# Altium project OPAL 6KVA - Half Bridge Eval.PrjPcb
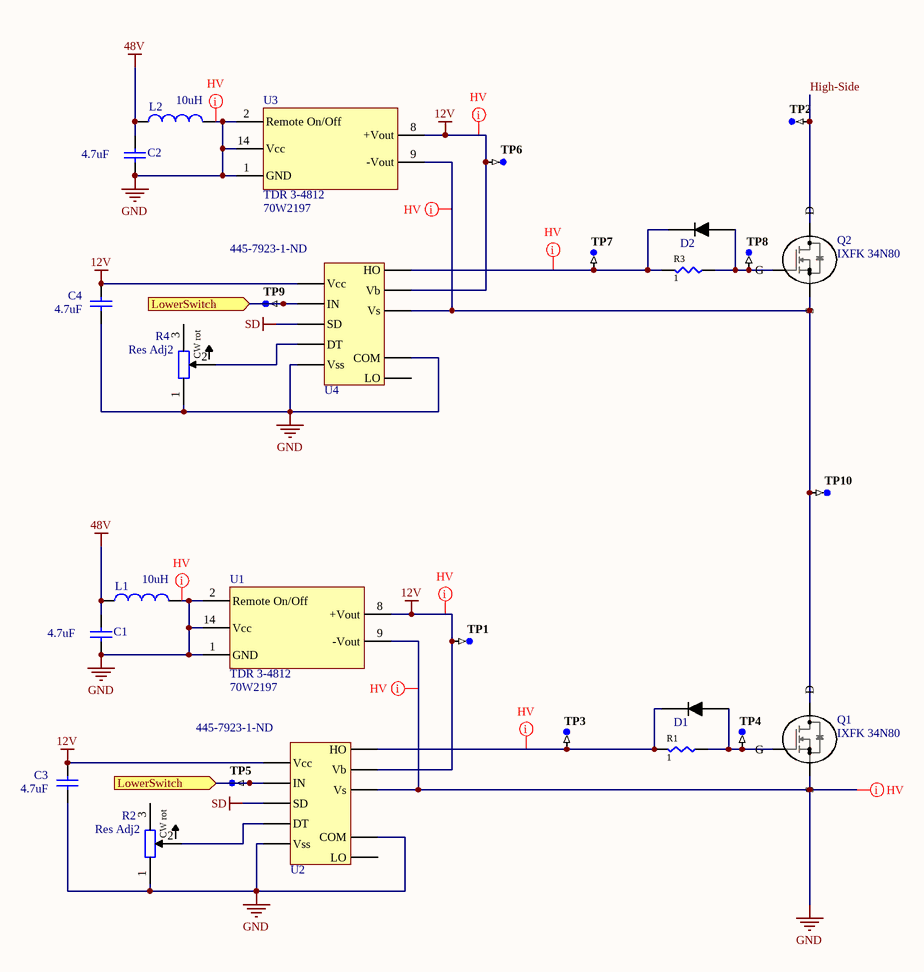
[diagram p0: Gate-drive.SchDoc]
1 sheet, 28 parts. Net scope: flat (ports and power ports of the same name join across sheets).
Board file: Half-bridge_eval.PcbDoc

## Sheet Gate-drive.SchDoc
size A4

### Parts
C1  value 4.7uF  [C4532]  (hidden comment: Cap)
C2  value 4.7uF  [C4532]  (hidden comment: Cap)
C3  value 4.7uF  Supplier Part Number 1: 445-7923-1-ND  [C4532]  (hidden comment: Cap)
C4  value 4.7uF  Supplier Part Number 1: 445-7923-1-ND  [C4532]  (hidden comment: Cap)
D1  1N4148  [DO-35_02]  (value not drawn)
D2  1N4148  [DO-35_02]  (value not drawn)
L1  value 10uH  [TCK-047]  (hidden comment: Inductor)
L2  value 10uH  [TCK-047]  (hidden comment: Inductor)
Q1  IXFK 34N80  [TO-264 AA]
Q2  IXFK 34N80  [TO-264 AA]
R1  1  [R_1206]
R2  Res Adj2  [CT-6EP]
R3  1  [R_1206]
R4  Res Adj2  [CT-6EP]
TP1  TP-SM-C-100  [TP-SM-C-100]  (value not drawn)  (no BOM)
TP2  TP-SM-C-100  [TP-SM-C-100]  (value not drawn)  (no BOM)
TP3  TP-SM-C-100  [TP-SM-C-100]  (value not drawn)  (no BOM)
TP4  TP-SM-C-100  [TP-SM-C-100]  (value not drawn)  (no BOM)
TP5  TP-SM-C-100  [TP-SM-C-100]  (value not drawn)  (no BOM)
TP6  TP-SM-C-100  [TP-SM-C-100]  (value not drawn)  (no BOM)
TP7  TP-SM-C-100  [TP-SM-C-100]  (value not drawn)  (no BOM)
TP8  TP-SM-C-100  [TP-SM-C-100]  (value not drawn)  (no BOM)
TP9  TP-SM-C-100  [TP-SM-C-100]  (value not drawn)  (no BOM)
TP10  TP-SM-C-100  [TP-SM-C-100]  (value not drawn)  (no BOM)
U1  TDR 3-4812  Supplier Part Number 1: 70W2197  [PID DC-DC Converter - duplicate]
U2  IR21094  [DIP14]  (value not drawn)
U3  TDR 3-4812  Supplier Part Number 1: 70W2197  [PID DC-DC Converter - duplicate]
U4  IR21094  [DIP14]  (value not drawn)

### Ports
LowerSwitch (in)

### Nets
12V: C3.2 C4.2 TP1.1 TP6.1 U1.8(+Vout) U2.1(Vcc) U2.13(Vb) U3.8(+Vout) U4.1(Vcc) U4.13(Vb)
48V: C1.2 C2.2 L1.1 L2.1
GND: C1.1 C2.1 C3.1 C4.1 L1.2 L2.2 Q1.3(S) R2.1 R4.1 U1.1(GND) U1.2(Remote_On/Off) U1.9(-Vout) U1.14(Vcc) U2.5(Vss) U2.6(COM) U2.11(Vs) U3.1(GND) U3.2(Remote_On/Off) U3.14(Vcc) U4.5(Vss) U4.6(COM)
SD: U2.3(SD) U4.3(SD)
High-Side: Q2.2(D) TP2.1
NetD1_1: D1.1(Cathode) R1.1 TP3.1 U2.12(HO)
NetD1_2: D1.2(Anode) Q1.1(G) R1.2 TP4.1
NetD2_1: D2.1(Cathode) R3.1 TP7.1 U4.12(HO)
NetD2_2: D2.2(Anode) Q2.1(G) R3.2 TP8.1
NetQ1_2: Q1.2(D) Q2.3(S) TP10.1 U3.9(-Vout) U4.11(Vs)
NetR2_2: R2.2 U2.4(DT)
NetR4_2: R4.2 U4.4(DT)
NetTP5_1: TP5.1 TP9.1 U2.2(IN) U4.2(IN) ; port LowerSwitch

Not connected (* = marked no-connect by the designer): R2 3; R4 3; U2 7(LO); U4 7(LO)

### Layout directives
net class HV: 12V, GND, NetD1_1, NetD2_1, NetQ1_2

### Notes on the sheet
- (in symbol Res Adj2) CW rot

### Library data of the parts
C1-C4 = Cap: Capacitor; Manufacturer: TDK; Manufacturer Part Number: CGA8N3X7S2A475K230KB; Tolerance: 10%; Voltage Rating: 100V; Dielectric: X7S; Published: 8-Jun-2000; LatestRevisionDate: 17-Jul-2002; LatestRevisionNote: Re-released for DXP Platform.; PackageReference: RAD-0.3; Publisher: Altium Limited; PackageDescription: Radial Cap, Thru-Hole; 2 Leads; 0.3 in Pin Spacing; Supplier 1: Digi-Key; Pricing 1: 1=1.92, 10=1.518, 100=1.1385 (USD); Case/Package: 1812; Weight: 0.000952oz; Case Code (Metric): 4532; Case Code (Imperial): 1812; Min Operating Temperature: -55°C; Max Operating Temperature: 125°C; Packaging: Tape and Reel; Capacitance: 4.7uF; Termination: SMD/SMT; Package Quantity: 1; Voltage Rating (DC): 100V; Composition: Ceramic; Length: 4.5mm; Height: 1.6mm; Width: 0.126inch; Thickness: 0.091inch; Depth: 3.2mm; REACH SVHC: No SVHC; ComponentLink1URL: https://datasheet.ciiva.com/24217/cga8n3x7s2a475k230kb-266118-24217101.pdf; ComponentLink1Description: https://datasheet.ciiva.com/24217/cga8n3x7s2a475k230kb-266118-24217101.pdf
  C1 C2: Supplier Part Number 1: 445-7923-1-ND; Stock 1: 236
  C3 C4: Stock 1: 0
D1 D2 = 1N4148: Diode; Manufacturer: Fairchild Semiconductor; Forward Voltage: 1V; Reverse Recovery Time: 4ns; Element Configuration: Single; Polarity: Standard; Current Rating: 200mA; Capacitance: 4pF; Voltage Rating (DC): 100V; Peak Non-Repetitive Surge Current: 4A; Max Forward Surge Current (Ifsm): 1A; Max Power Dissipation: 500mW; Peak Reverse Current: 5uA; Outside Diameter: 1.85mm; Supplier 1: Digi-Key; Manufacturer Part Number: 1N4148; Stock 1: 0; Pricing 1: 25=4 (USD); Mount: Through Hole; Number of Pins: 2; Weight: 0.01lb; Contact Plating: Tin; Min Operating Temperature: -65°C; Max Operating Temperature: 175°C; Packaging: Bulk; Output Current: 200mA; Forward Current: 200mA; Max Repetitive Reverse Voltage (Vrrm): 100V; Package Quantity: 2000; Recovery Time: 4ns; Max Surge Current: 4A; Reverse Voltage (DC): 100V; Average Rectified Current: 200mA; Power Dissipation: 500mW; Diameter: 1.91mm; Length: 4.56mm; Height: 4.56mm; Width: 1.91mm; Radiation Hardening: No; Lead Free: Lead Free; REACH SVHC: No SVHC; ComponentLink1URL: https://datasheet.ciiva.com/910/1n914-910546.pdf; ComponentLink1Description: https://datasheet.ciiva.com/910/1n914-910546.pdf; ComponentLink2URL: https://datasheet.ciiva.com/1242/1716967-1242233.pdf; ComponentLink2Description: https://datasheet.ciiva.com/1242/1716967-1242233.pdf; ComponentLink3URL: https://datasheet.ciiva.com/3304/fdll914b-3304217.pdf; ComponentLink3Description: https://datasheet.ciiva.com/3304/fdll914b-3304217.pdf; ComponentLink4URL: https://datasheet.ciiva.com/25951/fdll914b-25951516.pdf; ComponentLink4Description: https://datasheet.ciiva.com/25951/fdll914b-25951516.pdf; ComponentLink5URL: https://datasheet.ciiva.com/27049/743285-27049708.pdf; ComponentLink5Description: https://datasheet.ciiva.com/27049/743285-27049708.pdf; ComponentLink6URL: https://datasheet.ciiva.com/16740/1n4148-16740829.pdf; ComponentLink6Description: https://datasheet.ciiva.com/16740/1n4148-16740829.pdf; Supplier Part Number 1: 1N4148-DIE-ND
L1 L2 = Inductor: Code_IEC: 1005; Published: 8-Jun-2000; LatestRevisionDate: 29-May-2009; LatestRevisionNote: IPC-7351 Footprint Added.; PackageReference: 0402-A; Publisher: Altium Limited; PackageDescription: Chip Inductor; Code_JEITA: 0402
Q1 Q2 = IXFK 34N80: MOSFET 34A; Manufacturer: IXYS; Rise Time: 45ns; Rds On Max: 240mR; Input Capacitance: 7.5nF; Recovery Time: 250ns; Drain to Source Breakdown Voltage: 800V; Fall Time: 40ns; Power Dissipation: 560W; Turn-Off Delay Time: 100ns; Element Configuration: Single; Gate to Source Voltage (Vgs): 20V; Supplier 1: Digikey; Manufacturer Part Number: IXFK34N80; Stock 1: 25; Pricing 1: 1=22.64, 10=20.94, 25=19.2424, 100=17.884, 250=16.4126 (USD); Case/Package: TO-264-3; Min Operating Temperature: -55°C; Max Operating Temperature: 150°C; Package Quantity: 25; Packaging: Rail/Tube; Continuous Drain Current (ID): 34A; Drain to Source Resistance: 240mR; Drain to Source Voltage (Vdss): 800V; Max Power Dissipation: 560W; Current Rating: 34A; Voltage Rating (DC): 800V; Lead Free: Lead Free; ComponentLink1URL: https://datasheet.ciiva.com/4446/98560-63299-4446514.pdf; ComponentLink1Description: https://datasheet.ciiva.com/4446/98560-63299-4446514.pdf; ComponentLink2URL: https://datasheet.ciiva.com/16298/98560-16298076.pdf; ComponentLink2Description: https://datasheet.ciiva.com/16298/98560-16298076.pdf; ComponentLink3URL: https://datasheet.ciiva.com/940/98560-940430.pdf; ComponentLink3Description: https://datasheet.ciiva.com/940/98560-940430.pdf; ComponentLink4URL: https://datasheet.ciiva.com/14110/tb612985-e-14110030.pdf; ComponentLink4Description: https://datasheet.ciiva.com/14110/tb612985-e-14110030.pdf; ComponentLink5URL: https://datasheet.ciiva.com/26791/ixfk34n80-26791415.pdf; ComponentLink5Description: https://datasheet.ciiva.com/26791/ixfk34n80-26791415.pdf; Supplier Part Number 1: IXFK34N80-ND
R1 R3 = RES_SMD1: RES SMD 1% 1/4W 1206; Manufacturer: Panasonic Electronic Components; Manufacturer Part Number: ERJ-8ENF9101V; Power (Watts): 0.25W, 1/4W; Temperature Coefficient: ±100ppm/°C; Supplier 1: Digi-Key; RoHS: RoHS Compliant; Category: Resistors; Stock 1: 17632; Pricing 1: 1=0.15, 50=0.0424, 100=0.0313, 250=0.02384, 500=0.01908, 1000=0.01404 (CAD); Packaging: Digi-Reel®; Part Status: Active; Value: 1; Tolerance: ±1%; Composition: Thick Film; Features: Automotive AEC-Q200; Operating Temperature: -55°C ~ 155°C; Package / Case: 1206 (3216 Metric); Supplier Device Package: 1206; Size / Dimension: 0.126" L x 0.063" W (3.20mm x 1.60mm); Height: 0.028" (0.70mm); Number of Terminations: 2; Failure Rate: -; ComponentLink1URL: http://industrial.panasonic.com/www-cgi/jvcr13pz.cgi?E+PZ+3+AOA0002+ERJ8ENF9101V+7+WW; ComponentLink1Description: http://industrial.panasonic.com/www-cgi/jvcr13pz.cgi?E+PZ+3+AOA0002+ERJ8ENF9101V+7+WW; Supplier Part Number 1: P9.10KFDKR-ND
R2 R4 = Res Adj2: Variable Resistor; Manufacturer: Nidec Copal; Manufacturer Part Number: CT-6EP103; Set Position: 0.5; Resistance: 10KR; Tolerance: 10%; Number of Turns: 1; Max Power Dissipation: 500mW; Temperature Coefficient: 100ppm/°C; Published: 8-Jun-2000; LatestRevisionDate: 17-Jul-2002; LatestRevisionNote: Re-released for DXP Platform.; PackageReference: AXIAL-0.6; Publisher: Altium Limited; PackageDescription: Axial Device, Thru-Hole; 2 Leads; 0.6 in Pin Spacing; Supplier 1: Digikey; Stock 1: 31633; Pricing 1: 1=0.79, 10=0.711, 25=0.6428, 50=0.6196, 100=0.5852, 250=0.5623, 500=0.5279, 1000=0.4361, 5000=0.3557 (USD); Mount: Through Hole; Weight: 510mg; Colour: Blue; Contact Plating: Tin; Min Operating Temperature: -55°C; Max Operating Temperature: 120°C; Packaging: Bulk; Composition: Potentiometer; Termination: PC Pins; Length: 0.228inch; Lead Free: Lead Free; ComponentLink1URL: https://datasheet.ciiva.com/2156/ct-6-2156122.pdf; ComponentLink1Description: https://datasheet.ciiva.com/2156/ct-6-2156122.pdf; Supplier Part Number 1: CT6EP103-ND
TP1-TP10 = CMP-0484-00002-2: Test Point, Surface Mount, Circular, Pad Diameter 1 mm; Manufacturer: No Vendor; PartNumber: TP-SM-C-100
U1 U3 = TDR 3-4812: 48V-12V Converter; Manufacturer: Traco Power; Manufacturer Part Number: TDR3-4812WI; Nominal Input Voltage: 48V; Output Voltage: 12V; Output Current: 250mA; Number of Outputs: 1; Efficiency: 81%; Min Input Voltage: 36V; Max Input Voltage: 75V; Min Input Voltage (DC): 18V; Isolation Voltage: 1.5kV; Max Output Power: 3W; Supplier 1: Newark; Stock 1: 0; Min Operating Temperature: -40°C; Max Operating Temperature: 85°C; Nominal Output Voltage: 12V; Max Output Current: 250mA; Max Input Voltage (DC): 75V; Voltage - Output 1: 12V; Current - Output 1: 250mA; Length: 18.9mm; Height: 8.7mm; Width: 12.8mm; Depth: 18.9mm; REACH SVHC: No SVHC; ComponentLink1URL: https://datasheet.ciiva.com/7625/1763545-7625255.pdf; ComponentLink1Description: https://datasheet.ciiva.com/7625/1763545-7625255.pdf; ComponentLink2URL: https://datasheet.ciiva.com/3356/tdr3wi-eng-tds-3356635.pdf; ComponentLink2Description: https://datasheet.ciiva.com/3356/tdr3wi-eng-tds-3356635.pdf; ComponentLink3URL: https://datasheet.ciiva.com/26336/157237-da-01-de-dc-dc-wandler-tdr-3-4812wi-26336242.pdf; ComponentLink3Description: https://datasheet.ciiva.com/26336/157237-da-01-de-dc-dc-wandler-tdr-3-4812wi-26336242.pdf
U2 U4 = IR21094: HALF-BRIDGE DRIVER